# EAGLE schematic dcfsim (EAGLE 6.4)
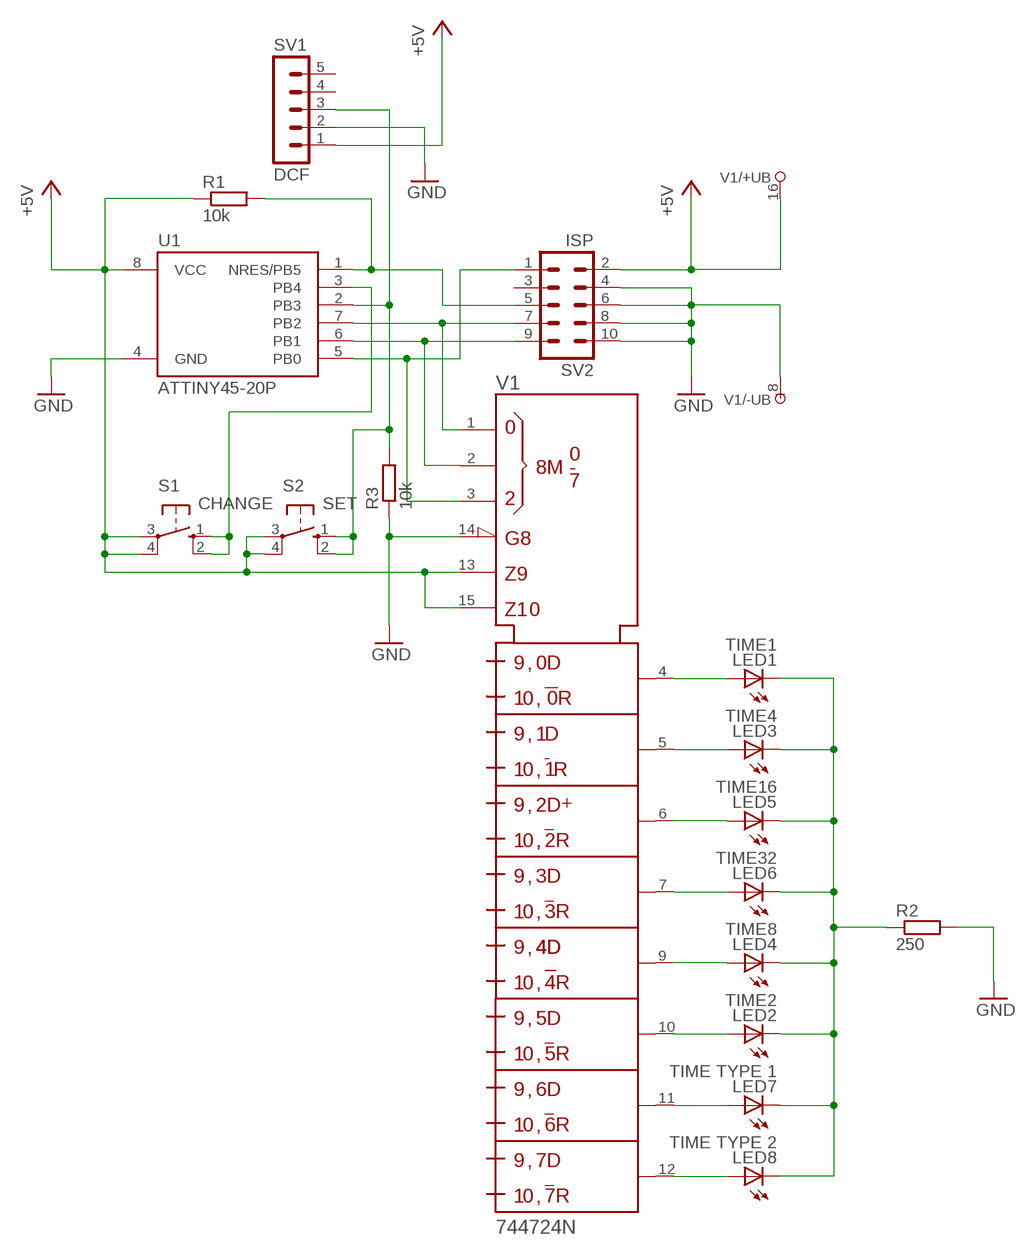
[diagram p0: schematic, sheet 1]

## Parts
LED1  TIME1  LED5MM  [LED5MM]
LED2  TIME2  LED5MM  [LED5MM]
LED3  TIME4  LED5MM  [LED5MM]
LED4  TIME8  LED5MM  [LED5MM]
LED5  TIME16  LED5MM  [LED5MM]
LED6  TIME32  LED5MM  [LED5MM]
LED7  TIME TYPE 1  LED5MM  [LED5MM]
LED8  TIME TYPE 2  LED5MM  [LED5MM]
R1  10k  R-EU_0204/5  [0204/5]
R2  250  R-EU_0204/5  [0204/5]
R3  10k  R-EU_0204/5  [0204/5]
S1  CHANGE  10-XX  [B3F-10XX]
S2  SET  10-XX  [B3F-10XX]
SV1  DCF  MA05-1  [MA05-1]
SV2  ISP  ML10  [ML10]
U1  ATTINY45-20P  [PDIP08_300MIL]
V1  744724N  [DIL16]

## Nets
+5V: R1.1 S1.3(P) S1.4(P1) S2.3(P) S2.4(P1) SV1.1 SV2.2 U1.8(VCC) V1.13(D) V1.15(CLR) V1.16(+UB)
GND: R2.2 R3.1 SV1.2 SV2.4 SV2.6 SV2.8 SV2.10 U1.4(GND) V1.8(-UB) V1.14(!G)
N$1: R1.2 SV2.5 U1.1(NRES/PB5)
N$2: SV2.7 U1.7(PB2) V1.1(S0)
N$3: SV2.9 U1.6(PB1) V1.2(S1)
N$4: SV2.1 U1.5(PB0) V1.3(S2)
N$5: R3.2 S2.1(S) S2.2(S1) SV1.3 U1.2(PB3)
N$6: LED1.A V1.4(Q0)
N$7: LED2.A V1.10(Q5)
N$8: LED4.A V1.9(Q4)
N$9: LED6.A V1.7(Q3)
N$10: LED5.A V1.6(Q2)
N$11: LED3.A V1.5(Q1)
N$13: S1.1(S) S1.2(S1) U1.3(PB4)
N$14: LED7.A V1.11(Q6)
N$15: LED8.A V1.12(Q7)
RROU: LED1.K(C) LED2.K(C) LED3.K(C) LED4.K(C) LED5.K(C) LED6.K(C) LED7.K(C) LED8.K(C) R2.1
Unconnected: SV1.4 SV1.5 SV2.3

## Library data of the parts
LED1-LED8 = led:LED: LED OSRAM: - CHIPLED LG R971, LG N971, LY N971, LG Q971, LY Q971, LO R971, LY R971 LH N974, LH R974 LS Q976, LO Q976, LY Q976 LO Q996 - Hyper CHIPLED LW Q18S LB Q993, LB Q99A, LB R99A - SideLED LS A670, LO A670, LY A670, LG A670, LP A670 LB A673, LV A673, LT A673, LW A673 LH A674 LY A675 LS A676, LA A676, LO A676, LY A676, LW A676 LS A679, LY A679, LG A679 - Hyper Micro SIDELED® LS Y876, LA Y876, LO Y876, LY Y876 LT Y87S - SmartLED LW L88C, LW L88S LB L89C, LB L89S, LG L890 LS L89K, LO L89K, LY L89K LS L896, LA L896, LO L896, LY L896 - TOPLED LS T670, LO T670, LY T670, LG T670, LP T670 LSG T670, LSP T670, LSY T670, LOP T670, LYG T670 LG T671, LOG T671, LSG T671 LB T673, LV T673, LT T673, LW T673 LH T674 LS T676, LA T676, LO T676, LY T676, LB T676, LH T676, LSB T676, LW T676 LB T67C, LV T67C, LT T67C, LS T67K, LO T67K, LY T67K, LW E67C LS E67B, LA E67B, LO E67B, LY E67B, LB E67C, LV E67C, LT E67C LW T67C LS T679, LY T679, LG T679 LS T770, LO T770, LY T770, LG T770, LP T770 LB T773, LV T773, LT T773, LW T773 LH T774 LS E675, LA E675, LY E675, LS T675 LS T776, LA T776, LO T776, LY T776, LB T776 LHGB T686 LT T68C, LB T68C - Hyper Mini TOPLED® LB M676 - Mini TOPLED Santana® LG M470 LS M47K, LO M47K, LY M47K Source: http://www.osram.convergy.de LUXEON: - LUMILED® LXK2-PW12-R00, LXK2-PW12-S00, LXK2-PW14-U00, LXK2-PW14-V00 LXK2-PM12-R00, LXK2-PM12-S00, LXK2-PM14-U00 LXK2-PE12-Q00, LXK2-PE12-R00, LXK2-PE12-S00, LXK2-PE14-T00, LXK2-PE14-U00 LXK2-PB12-K00, LXK2-PB12-L00, LXK2-PB12-M00, LXK2-PB14-N00, LXK2-PB14-P00, LXK2-PB14-Q00 LXK2-PR12-L00, LXK2-PR12-M00, LXK2-PR14-Q00, LXK2-PR14-R00 LXK2-PD12-Q00, LXK2-PD12-R00, LXK2-PD12-S00 LXK2-PH12-R00, LXK2-PH12-S00 LXK2-PL12-P00, LXK2-PL12-Q00, LXK2-PL12-R00 Source: www.luxeon.com KINGBRIGHT: KA-3528ASYC Source: www.kingbright.com
R1-R3 = resistor:R-EU_: RESISTOR, European symbol
S1 S2 = switch-omron:10-XX: OMRON SWITCH; MPN: B3F-1000; OC_FARNELL: 176432; OC_NEWARK: 36M3542
SV1 = con-lstb:MA05-1: PIN HEADER; OC_FARNELL: unknown; OC_NEWARK: unknown
SV2 = con-harting-ml:ML10: HARTING; OC_FARNELL: unknown; OC_NEWARK: unknown
U1 = _hhn_attiny25_45_85:ATTINY45*: ATMEL ATtiny 45 Packages: P = PDIP 08 30mil S = SOIC 08 EIAJ 208mil X = TSSOP 08 4.4mm Technologies Note: for complete ordering code (temp. range, finish, tape&reel etc.) see www.atmel.com • Supply Voltage: V = (1.8…5.5)V | [blank] = (2.7…5.5)V • Speed: 10 = 10 MHz | 20 = 20 MHz Author: Dipl.-Ing. FH Rainer Bayer HHN Hochschule Heilbronn (Heilbronn University), rainer.bayer@hs-heilbronn.de Ingenieurbüro ing-rb, mail@ing-rb.de
V1 = 74ttl-din:74*4724: 8 Bit Addressable LATCH